# EAGLE design sensor (EAGLE 9.2.2)
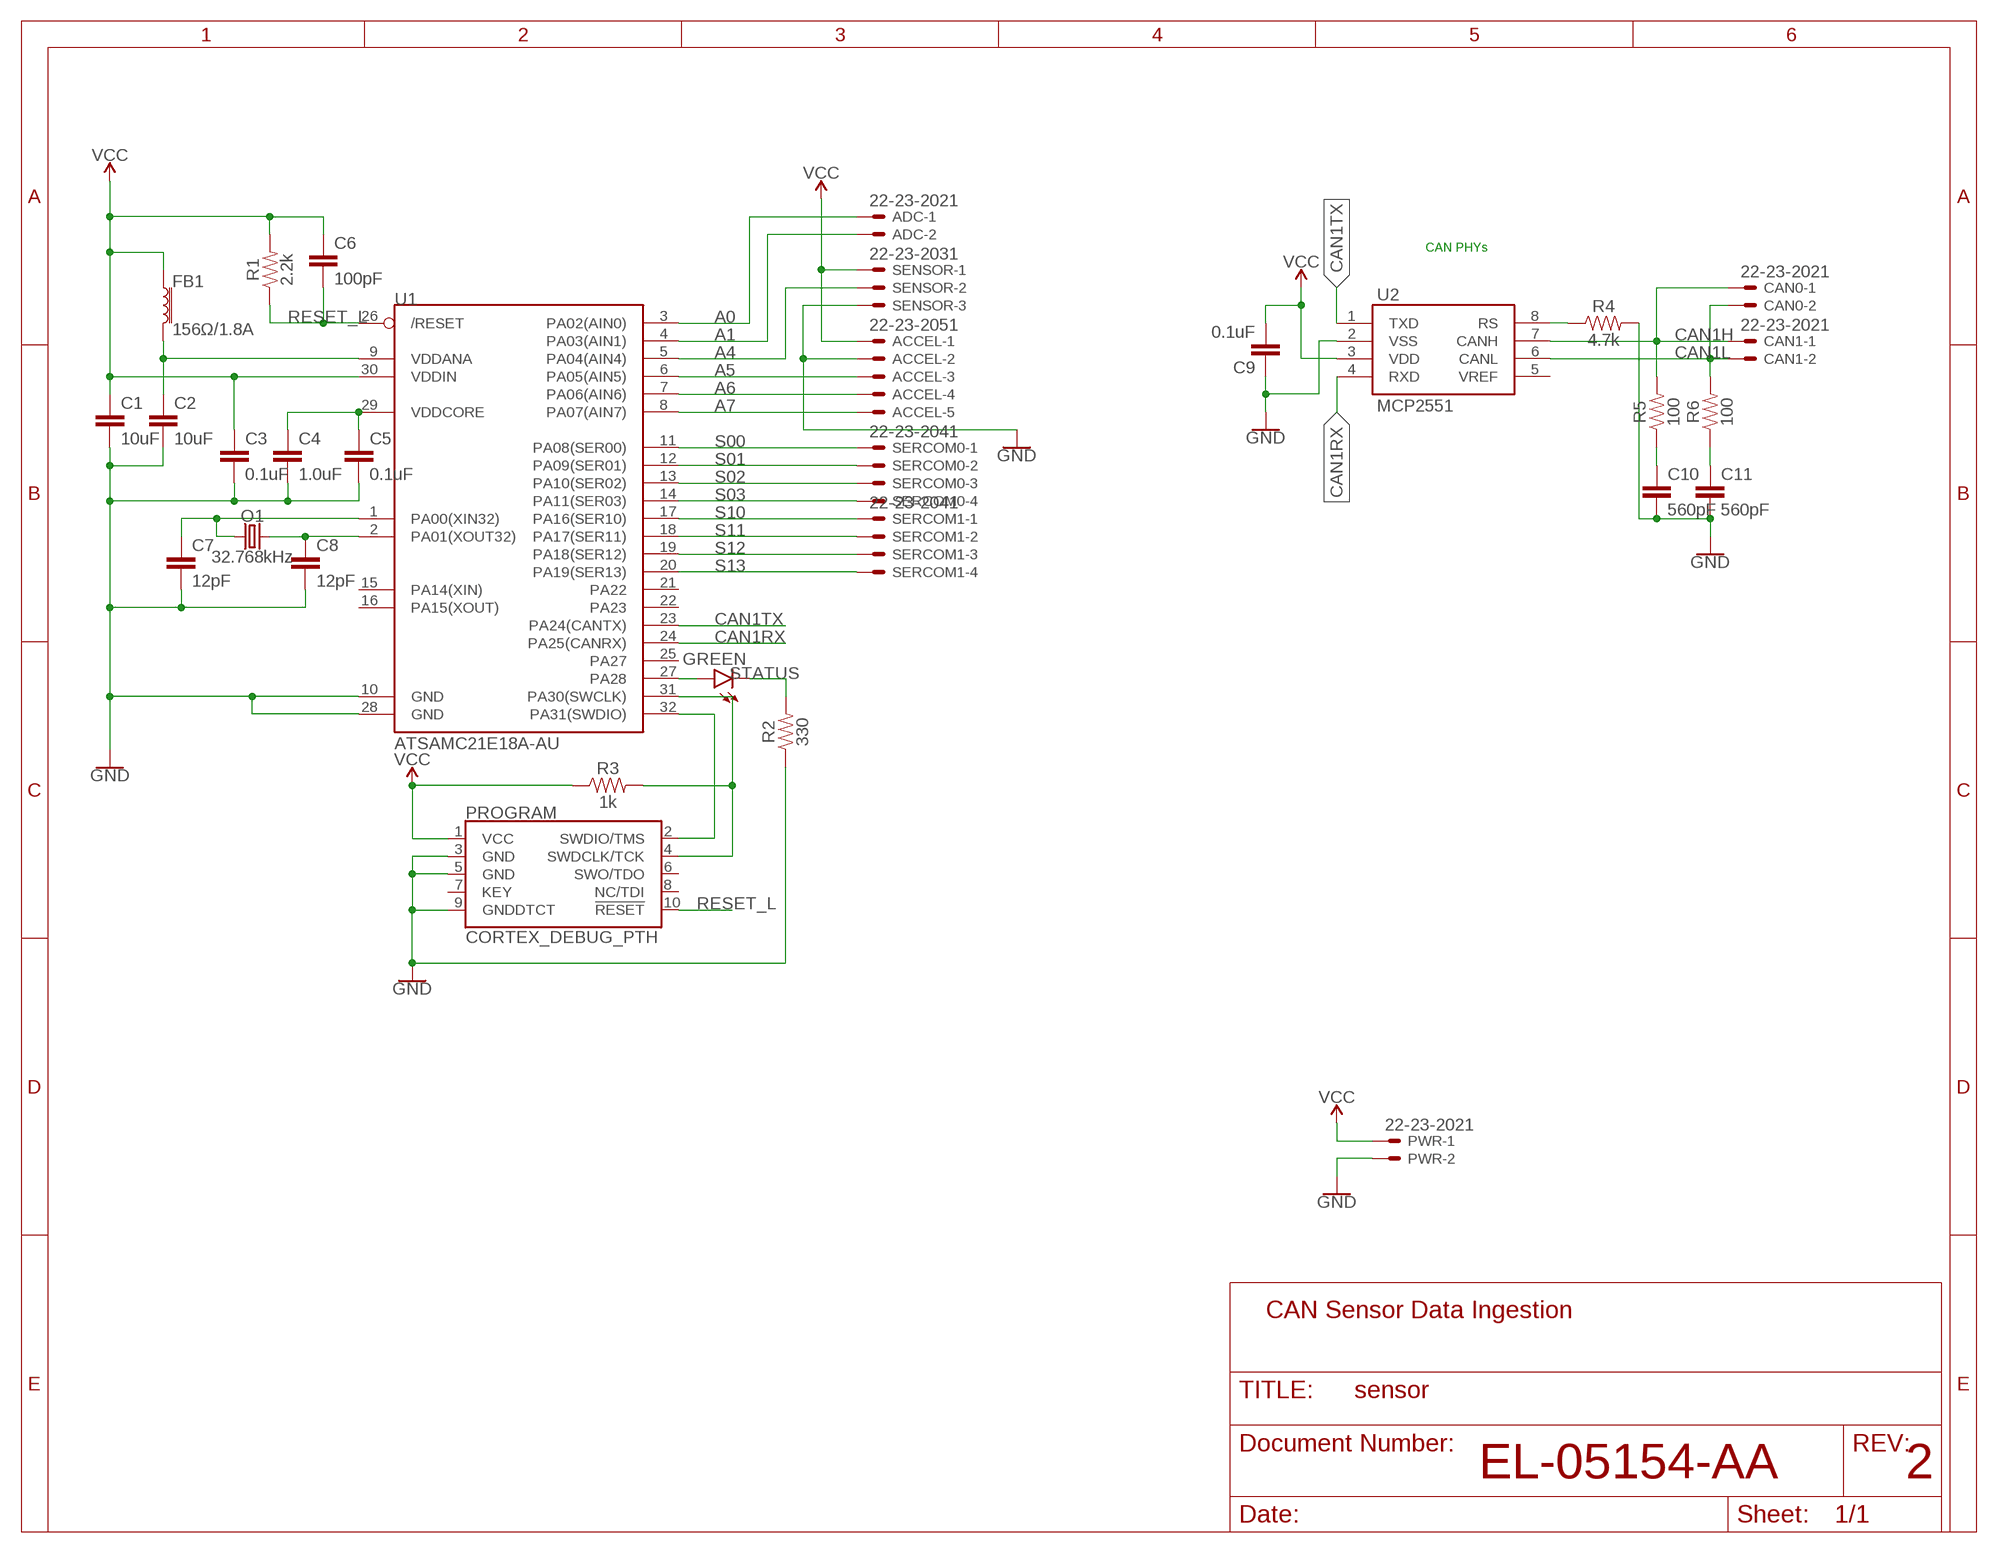
[diagram p0: schematic, sheet 1]

## Parts
ACCEL  22-23-2051  [22-23-2051]
ADC  22-23-2021  [22-23-2021]
C1  10uF  10UF-0603-6.3V-20%  [0603]
C2  10uF  10UF-0603-6.3V-20%  [0603]
C3  0.1uF  0.1UF-0603-25V-(+80/-20%)  [0603]
C4  1.0uF  1.0UF-0603-16V-10%  [0603]
C5  0.1uF  0.1UF-0603-25V-(+80/-20%)  [0603]
C6  100pF  100PF-0603-50V-5%  [0603]
C7  12pF  12PF-0603-50V-5%  [0603]
C8  12pF  12PF-0603-50V-5%  [0603]
C9  0.1uF  0.1UF-0603-25V-(+80/-20%)  [0603]
C10  560pF  560PF-0603-50V-5%  [0603]
C11  560pF  560PF-0603-50V-5%  [0603]
CAN0  22-23-2021  [22-23-2021]
CAN1  22-23-2021  [22-23-2021]
FB1  156Ω/1.8A  FERRITE_BEAD-0603  [0603]
O1  32.768kHz  CRYSTAL-32.768KHZPTH-2X6  [CRYSTAL-PTH-2X6-CYL]
PROGRAM  CORTEX_DEBUG_PTH  [2X5-PTH-1.27MM]
PWR  22-23-2021  [22-23-2021]
R1  2.2k  2.2KOHM-0603-1/10W-1%  [0603]
R2  330  330OHM-0603-1/10W-1%  [0603]
R3  1k  1KOHM-0603-1/10W-1%  [0603]
R4  4.7k  4.7KOHM-0603-1/10W-1%  [0603]
R5  100  100OHM-0603-1/4W-5%  [0603]
R6  100  100OHM-0603-1/4W-5%  [0603]
SENSOR  22-23-2031  [22-23-2031]
SERCOM0  22-23-2041  [22-23-2041]
SERCOM1  22-23-2041  [22-23-2041]
STATUS  GREEN  LED3MM  [LED_3MM]
U1  ATSAMC21E18A-AU  [TQFP32-08]
U2  MCP2551  [SO08]

## Nets
A0: ADC.1 U1.3(PA02(AIN0))
A1: ADC.2 U1.4(PA03(AIN1))
A4: SENSOR.2 U1.5(PA04(AIN4))
A5: ACCEL.3 U1.6(PA05(AIN5))
A6: ACCEL.4 U1.7(PA06(AIN6))
A7: ACCEL.5 U1.8(PA07(AIN7))
C1HRC: C10.1 R5.1
C1LRC: C11.1 R6.1
C1RS: R4.1 U2.8(RS)
CAN1H: CAN0.1 CAN1.1 R5.2 U2.7(CANH)
CAN1L: CAN0.2 CAN1.2 R6.2 U2.6(CANL)
CAN1RX: U1.24(PA25(CANRX)) U2.4(RXD)
CAN1TX: U1.23(PA24(CANTX)) U2.1(TXD)
GND [power]: ACCEL.2 C1.2 C2.2 C3.2 C4.2 C5.2 C7.2 C8.2 C9.1 C10.2 C11.2 PROGRAM.3(GND) PROGRAM.5(GND) PROGRAM.9(GNDDTCT) PWR.2 R2.1 R4.2 SENSOR.3 U1.10(GND) U1.28(GND) U2.2(VSS)
LEDA: STATUS.A U1.27(PA28)
LEDC: R2.2 STATUS.K(C)
RESET_L: C6.2 PROGRAM.10(!RESET) R1.1 U1.26(/RESET)
S00: SERCOM0.1 U1.11(PA08(SER00))
S01: SERCOM0.2 U1.12(PA09(SER01))
S02: SERCOM0.3 U1.13(PA10(SER02))
S03: SERCOM0.4 U1.14(PA11(SER03))
S10: SERCOM1.1 U1.17(PA16(SER10))
S11: SERCOM1.2 U1.18(PA17(SER11))
S12: SERCOM1.3 U1.19(PA18(SER12))
S13: SERCOM1.4 U1.20(PA19(SER13))
SWDCLK: PROGRAM.4(SWDCLK/TCK) R3.2 U1.31(PA30(SWCLK))
SWDIO: PROGRAM.2(SWDIO/TMS) U1.32(PA31(SWDIO))
VCC [power]: ACCEL.1 C1.1 C3.1 C6.1 C9.2 FB1.1 PROGRAM.1(VCC) PWR.1 R1.2 R3.1 SENSOR.1 U1.30(VDDIN) U2.3(VDD)
VDDANA: C2.1 FB1.2 U1.9(VDDANA)
VDDCORE: C4.1 C5.1 U1.29(VDDCORE)
XIN32: C7.1 O1.1 U1.1(PA00(XIN32))
XOUT32: C8.1 O1.2 U1.2(PA01(XOUT32))
Unconnected: PROGRAM.6(SWO/TDO) PROGRAM.7(KEY) PROGRAM.8(NC/TDI) U1.15(PA14(XIN)) U1.16(PA15(XOUT)) U1.21(PA22) U1.22(PA23) U1.25(PA27) U2.5(VREF)

## Notes on the sheet
- CAN PHYs
- CAN Sensor Data Ingestion
- EL-05154-AA | 2

## Library data of the parts
ACCEL = con-molex:22-23-2051: .100" (2.54mm) Center Header - 5 Pin; MF: MOLEX; MPN: 22-23-2051; OC_FARNELL: 1462952; OC_NEWARK: 38C9178
ADC CAN0 CAN1 PWR = con-molex:22-23-2021: .100" (2.54mm) Center Header - 2 Pin; MF: MOLEX; MPN: 22-23-2021; OC_FARNELL: 1462926; OC_NEWARK: 25C3832
C1 C2 = SparkFun-Capacitors:10UF: 10.0µF ceramic capacitors A capacitor is a passive two-terminal electrical component used to store electrical energy temporarily in an electric field.; PROD_ID: CAP-11015
C3 C5 C9 = SparkFun-Capacitors:0.1UF: 0.1µF ceramic capacitors A capacitor is a passive two-terminal electrical component used to store electrical energy temporarily in an electric field.; PROD_ID: CAP-00810
C4 = SparkFun-Capacitors:1.0UF: 1µF ceramic capacitors A capacitor is a passive two-terminal electrical component used to store electrical energy temporarily in an electric field.; PROD_ID: CAP-00868
C6 = SparkFun-Capacitors:100PF: 100pF/0.1nF ceramic capacitors A capacitor is a passive two-terminal electrical component used to store electrical energy temporarily in an electric field.; PROD_ID: CAP-07883
C7 C8 = SparkFun-Capacitors:12PF: 12pF ceramic capacitors A capacitor is a passive two-terminal electrical component used to store electrical energy temporarily in an electric field.; PROD_ID: CAP-09137
C10 C11 = SparkFun-Capacitors:560PF: 0.56nF/560pF ceramic capacitors A capacitor is a passive two-terminal electrical component used to store electrical energy temporarily in an electric field.; PROD_ID: CAP-08749
FB1 = SparkFun-Coils:FERRITE_BEAD: Ferrite Bead (blocks, cores, rings, chokes, etc.) Inductor with layers of ferrite used to suppress high frequencies. Often used to isolate high frequency noise. SparkFun Products: IOIO-OTG - V2.2 <https://www.sparkfun.com/products/13613> SparkFun SAMD21 Mini Breakout <https://www.sparkfun.com/products/13664> SparkFun 6 Degrees of Freedom Breakout - LSM6DS3 <https://www.sparkfun.com/products/13339> SparkFun SAMD21 Dev Breakout <https://www.sparkfun.com/products/13672>; PROD_ID: NDUC-07859; VALUE: 30Ω/1.8A
O1 = SparkFun-Clocks:CRYSTAL-32.768KHZ: 32.768kHz Crystal Frequency: 32.768kHz Frequency Stability: ±20ppm Load Capacitance: 12.5pF (PTH-2X6 & SMD-3.2X1.5), 6pF (SMD-2X6) SparkFun Products: SparkFun BigTime Watch Kit <https://www.sparkfun.com/products/11734> SparkFun nRF52832 Breakout <https://www.sparkfun.com/products/13990> SparkFun Real Time Clock Module <https://www.sparkfun.com/products/12708>; PROD_ID: XTAL-10112
PROGRAM = SparkFun-Connectors:CORTEX_DEBUG: Cortex Debug Connector - 10 pin Supports JTAG debug, Serial Wire debug, and Serial Wire Viewer. PTH and SMD connector options available. General Connector Information <http://infocenter.arm.com/help/topic/com.arm.doc.faqs/attached/13634/cortex_debug_connectors.pdf> Products: PTH Connector <http://www.digikey.com/product-detail/en/cnc-tech/3220-10-0100-00/1175-1627-ND/3883661> -via Digi-Key SparkFun PSoc <https://www.sparkfun.com/products/13229> SparkFun T <https://www.sparkfun.com/products/13810>
R1 = SparkFun-Resistors:2.2KOHM: 2.2kΩ resistor A resistor is a passive two-terminal electrical component that implements electrical resistance as a circuit element. Resistors act to reduce current flow, and, at the same time, act to lower voltage levels within circuits. - Wikipedia; PROD_ID: RES-08272
R2 = SparkFun-Resistors:330OHM: 330Ω resistor A resistor is a passive two-terminal electrical component that implements electrical resistance as a circuit element. Resistors act to reduce current flow, and, at the same time, act to lower voltage levels within circuits. - Wikipedia; PROD_ID: RES-00818
R3 = SparkFun-Resistors:1KOHM: 1kΩ resistor A resistor is a passive two-terminal electrical component that implements electrical resistance as a circuit element. Resistors act to reduce current flow, and, at the same time, act to lower voltage levels within circuits. - Wikipedia; PROD_ID: RES-07856
R4 = SparkFun-Resistors:4.7KOHM: 4.7kΩ resistor A resistor is a passive two-terminal electrical component that implements electrical resistance as a circuit element. Resistors act to reduce current flow, and, at the same time, act to lower voltage levels within circuits. - Wikipedia; PROD_ID: RES-07857
R5 R6 = SparkFun-Resistors:100OHM: 100Ω resistor A resistor is a passive two-terminal electrical component that implements electrical resistance as a circuit element. Resistors act to reduce current flow, and, at the same time, act to lower voltage levels within circuits. - Wikipedia; PROD_ID: RES-12438
SENSOR = con-molex:22-23-2031: .100" (2.54mm) Center Header - 3 Pin; MF: MOLEX; MPN: 22-23-2031; OC_FARNELL: 1462950; OC_NEWARK: 30C0862
SERCOM0 SERCOM1 = con-molex:22-23-2041: .100" (2.54mm) Center Header - 4 Pin; MF: MOLEX; MPN: 22-23-2041; OC_FARNELL: 1462920; OC_NEWARK: 38C0355
STATUS = SparkFun-LED:LED: LED (Generic) Standard schematic elements and footprints for 5mm, 3mm, 1206, and 0603 sized LEDs. Generic LEDs with no color specified.; PROD_ID: DIO-08794
U1 = washuracing:ATSAMC21E18A-AU: 5-Volt 32-Bit ARM Cortex M0+ MCU with CAN-FD
U2 = SparkFun-IC-Comms:MCP2551: MCP2551 High Speed CAN Transceiver High speed CAN transceiver Datasheet <http://www.sparkfun.com/datasheets/DevTools/Arduino/MCP2551.pdf> SparkFun Products CAN-BUS Shield <https://www.sparkfun.com/products/13262> (DEV-13262) SparkFun OBD-II UART <https://www.sparkfun.com/products/9555> (WIG-09555); PROD_ID: IC-09907

## Net classes
0 default: width 0.203 mm
1 power: width 0.406 mm

## Board
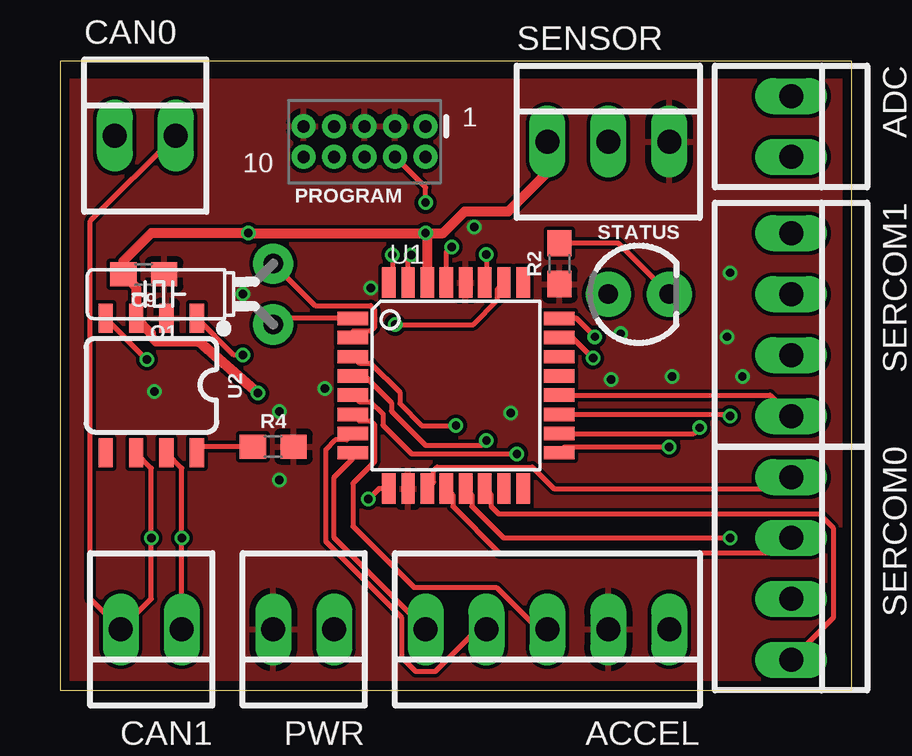
[diagram p1: board, top side]
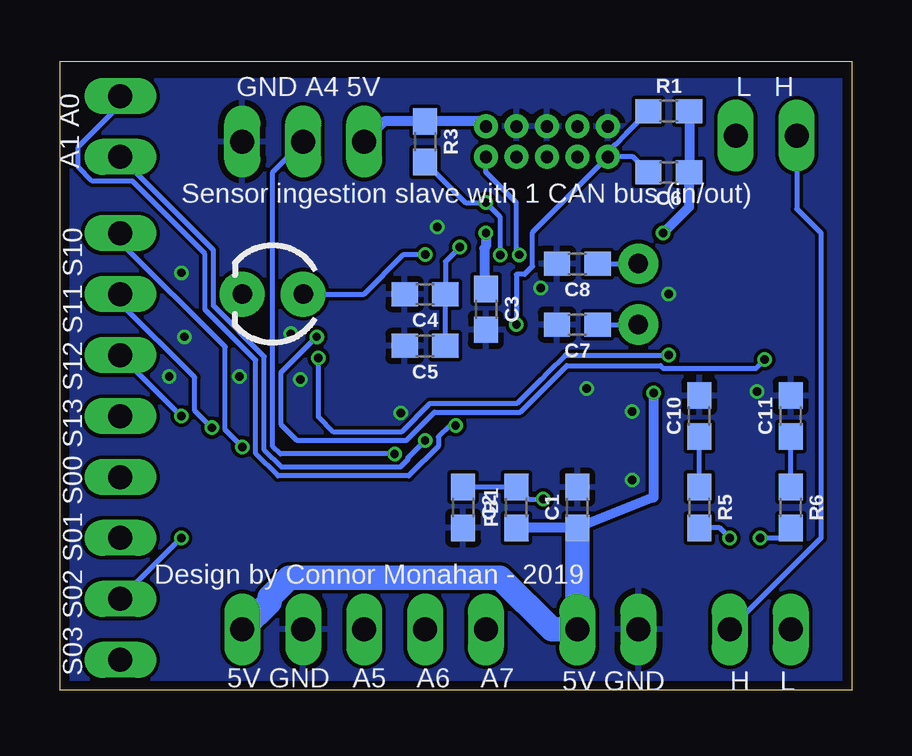
[diagram p2: board, bottom side, seen from below]

Size 33 x 26.21 mm. Coordinates in mm from the lower left corner, seen from the top.
Outline: 0,0 33,0 33,26.21 0,26.21 0,0
Copper layers (1*16): Top 0.035559375mm / dielectric 1.6mm / Bottom 0.035559375mm
Design rules "oshpark-2layer *": minimum track width 6mil, minimum drill 10mil, track to track 6mil, track to pad 6mil, pad to pad 6mil, via to via 6mil, smd to smd 6mil, copper to edge 15mil, drill to drill 6mil, minimum pad ring 5mil, minimum via ring 5mil, stop-mask expansion 2.5mil, vias tented up to drill 20mil, thermal gap 10mil

### Footprints (pad centres in the part's own frame; a part is rotated, then mirrored left to right if it is on the bottom)
22-23-2051 = drill 1 long: 1 -5.08,0; 2 -2.54,0; 3 0,0; 4 2.54,0; 5 5.08,0
22-23-2021 = drill 1 long: 1 -1.27,0; 2 1.27,0
0603 = smd 1.1 x 1: 1 -0.85,0; 2 0.85,0
CRYSTAL-PTH-2X6-CYL = drill 0.813 pad 1.676: 1 -1.27,0; 2 1.27,0
2X5-PTH-1.27MM = drill 0.508 pad 1: 1 -2.54,-0.635; 2 -2.54,0.635; 3 -1.27,-0.635; 4 -1.27,0.635; 5 0,-0.635; 6 0,0.635; 7 1.27,-0.635; 8 1.27,0.635; 9 2.54,-0.635; 10 2.54,0.635
22-23-2031 = drill 1 long: 1 -2.54,0; 2 0,0; 3 2.54,0
22-23-2041 = drill 1 long: 1 -3.81,0; 2 -1.27,0; 3 1.27,0; 4 3.81,0
LED_3MM = drill 0.813 pad 1.88: A -1.27,0; K 1.27,0
TQFP32-08 = smd 1.27 x 0.559: 1 -4.293,2.8; 2 -4.293,2; 3 -4.293,1.2; 4 -4.293,0.4; 5 -4.293,-0.4; 6 -4.293,-1.2; 7 -4.293,-2; 8 -4.293,-2.8; 17 4.293,-2.8; 18 4.293,-2; 19 4.293,-1.2; 20 4.293,-0.4; 21 4.293,0.4; 22 4.293,1.2; 23 4.293,2; 24 4.293,2.8 | smd 0.559 x 1.27: 9 -2.8,-4.293; 10 -2,-4.293; 11 -1.2,-4.293; 12 -0.4,-4.293; 13 0.4,-4.293; 14 1.2,-4.293; 15 2,-4.293; 16 2.8,-4.293; 25 2.8,4.293; 26 2,4.293; 27 1.2,4.293; 28 0.4,4.293; 29 -0.4,4.293; 30 -1.2,4.293; 31 -2,4.293; 32 -2.8,4.293
SO08 = smd 0.6 x 1.2: 1 -1.905,-2.8; 2 -0.635,-2.8; 3 0.635,-2.8; 4 1.905,-2.8; 5 1.905,2.8; 6 0.635,2.8; 7 -0.635,2.8; 8 -1.905,2.8

### Placement (x,y rotation side)
ACCEL  20.32,2.54 180 top
ADC  30.48,23.5 270 top
C1  11.43,7.62 90 bottom
C2  16.19,7.62 270 bottom
C3  15.24,15.88 270 bottom
C4  17.78,16.51 180 bottom
C5  17.78,14.35 180 bottom
C6  7.62,21.59 180 bottom
C7  11.43,15.24 180 bottom
C8  11.43,17.78 180 bottom
C9  3.49,17.34 180 top
C10  6.35,11.43 90 bottom
C11  2.54,11.43 90 bottom
CAN0  3.56,23.11 0 top
CAN1  3.81,2.54 180 top
FB1  13.97,7.62 90 bottom
O1  8.89,16.51 90 top
PROGRAM  12.7,22.86 180 top
PWR  10.16,2.54 180 top
R1  7.62,24.13 0 bottom
R2  20.83,17.78 90 top
R3  17.78,22.86 270 bottom
R4  8.89,10.16 0 top
R5  6.35,7.62 270 bottom
R6  2.54,7.62 270 bottom
SENSOR  22.86,22.86 0 top
SERCOM0  30.48,5.08 270 top
SERCOM1  30.48,15.24 270 top
STATUS  24.13,16.51 0 top
U1  16.51,12.7 0 top
U2  3.81,12.7 180 top

### Tracks (layer width: path | path; a pad name or v marks a point on that pad's centre or on a via)
A0  (via drill 0.35)
  Top 0.203: v16.51,11.03 15.08,11.03 14.17,11.94 14.17,12.42 12.96,13.63 12.48,13.63 U1.3
  Bottom 0.203: v16.51,11.03 16.75,11.03 17.22,10.56 17.22,10.18 18.46,8.94 23.92,8.94 24.84,9.87 24.84,13.76 26.95,15.87 26.95,18.19 29.98,21.22 31.65,21.22 32.23,21.81 32.23,22.64 30.48,24.39 ADC.1
A1  (via drill 0.35)
  Top 0.203: U1.4 12.69,13.1 13.82,11.97 13.82,11.63 15.24,10.21 17.58,10.21 v17.78,10.41
  Bottom 0.203: ADC.2 26.59,18.34 26.59,16.02 24.49,13.91 24.49,10.01 23.77,9.3 18.82,9.3 18.49,9.62 18.49,9.69 v17.78,10.41
A4  (via drill 0.35)
  Top 0.203: v19.05,9.85 14.66,9.85 13.46,11.05 13.46,11.53 12.96,12.03 12.48,12.03 U1.5
  Bottom 0.203: v19.05,9.85 23.82,9.85 24.13,10.16 24.13,21.59 SENSOR.2
A5
  Top 0.203: U1.6 12.48,11.23 12.96,11.23 13.11,11.09 13.11,9.52 12.22,8.63 12.22,6.83 14.76,4.29 18.2,4.29 19.95,2.54 ACCEL.3
A6
  Top 0.203: U1.7 11.95,10.43 11.48,10.43 11.07,10.03 11.07,6.2 14.24,3.04 14.24,1.37 14.82,0.79 15.66,0.79 17.41,2.54 ACCEL.4
A7
  Top 0.203: U1.8 12.22,9.68 11.43,8.89 11.43,6.35 ACCEL.5
C1HRC
  Bottom 0.203: R5.1 C10.1
C1LRC
  Bottom 0.203: R6.1 C11.1
C1RS
  Top 0.203: R4.1 5.97,10.16 U2.8
CAN1H  (via drill 0.35)
  Top 0.203: CAN1.1 v5.08,6.35 5.08,9.27 U2.7
  Bottom 0.203: CAN1.1 1.27,6.35 1.27,19.05 2.29,20.07 CAN0.1 | v5.08,6.35 5.5,6.77 R5.2
CAN1L  (via drill 0.35)
  Top 0.203: CAN0.2 1.27,19.56 1.27,3.81 CAN1.2 3.81,3.81 v3.81,6.35 3.81,9.27 U2.6
  Bottom 0.203: v3.81,6.35 2.96,6.35 R6.2
CAN1RX  (via drill 0.35)
  Top 0.203: U2.4 v3.62,13.78 | v22.3,14.73 21.53,15.5 U1.24
  Bottom 0.203: v22.3,14.73 23.77,13.26 23.77,11.07 23.11,10.41 18.57,10.41 17.38,11.59 13.81,11.59 11.87,13.53 7.96,13.53 7.85,13.41 3.99,13.41 v3.62,13.78
CAN1TX  (via drill 0.35)
  Top 0.203: v22.23,13.84 21.37,14.7 U1.23 | v7.62,13.97 7.25,13.97 U2.1
  Bottom 0.203: v22.23,13.84 22.23,11.4 21.59,10.76 18.77,10.76 17.59,11.95 13.96,11.95 12.95,12.95 12.65,13.26 11.93,13.97 v7.62,13.97
GND  (via drill 0.35)
  other vias: 17.27,19.3 18.8,11.56 23.37,14.86 3.94,12.45 7.62,16.51 12.95,16.76 11.05,12.57 22.99,12.95 25.53,13.08 27.81,14.73 28.45,13.08 27.94,17.4 9.14,11.62 9.14,8.76
  pour Top: 0,0 0,25.4 33.02,25.4 33.02,0
  pour Bottom: 0,0 0,25.4 33.02,25.4 33.02,0
LEDA  (via drill 0.35)
  Top 0.203: v17.78,18.16 17.78,17.06 U1.27
  Bottom 0.203: STATUS.A 20.32,16.51 18.67,18.16 v17.78,18.16
LEDC
  Top 0.203: R2.2 23.28,18.63 STATUS.K
RESET_L  (via drill 0.35)
  Top 0.203: U1.26 18.24,16.73 18.24,16.25 17.23,15.24 v13.97,15.24
  Bottom 0.203: PROGRAM.10 13.3,19.09 13.3,17.66 13.63,17.34 13.97,17.34 v13.97,15.24 | PROGRAM.10 10.16,22.44 9.86,22.74 9.85,22.74 9.41,23.18 9.41,23.19 R1.1 | C6.2 9.11,22.23 PROGRAM.10
S00
  Top 0.203: SERCOM0.1 30,8.41 20.58,8.41 19.7,9.3 15.72,9.3 15.58,9.15 15.58,8.67 U1.11
S01
  Top 0.203: U1.12 16.38,8.14 16.38,7.67 18.33,5.71 29.84,5.71 SERCOM0.2
S02  (via drill 0.35)
  Top 0.203: U1.13 17.18,8.14 17.18,7.67 18.49,6.35 v27.94,6.35
  Bottom 0.203: v27.94,6.35 SERCOM0.3
S03
  Top 0.203: U1.14 17.98,8.14 17.98,7.67 18.29,7.35 31.65,7.35 32.23,6.77 32.23,3.02 SERCOM0.4
S10  (via drill 0.35)
  Top 0.203: U1.17 21.05,10.14 v25.4,10.14
  Bottom 0.203: v25.4,10.14 26.11,10.86 26.11,14.31 30.48,18.68 SERCOM1.1
S11  (via drill 0.35)
  Top 0.203: U1.18 26.43,10.7 v26.67,10.94
  Bottom 0.203: v26.67,10.94 27.38,11.66 27.38,13.04 30.48,16.14 SERCOM1.2
S12  (via drill 0.35)
  Top 0.203: U1.19 27.87,11.5 v27.94,11.43
  Bottom 0.203: v27.94,11.43 SERCOM1.3
S13
  Top 0.203: U1.20 29.61,12.3 SERCOM1.4
SWDCLK  (via drill 0.35)
  Top 0.203: U1.31 14.51,18 v14.65,18.15 | v15.24,20.32 15.24,20.95 PROGRAM.4
  Bottom 0.203: v14.65,18.15 14.65,19.73 v15.24,20.32 16.09,20.32 R3.2
SWDIO  (via drill 0.35)
  Top 0.203: U1.32 13.86,17.14 v13.86,18.15
  Bottom 0.203: v13.86,18.15 13.97,18.26 13.97,20.32 15.24,21.59 PROGRAM.2
VCC  (via drill 0.35)
  Top 0.406: v15.24,19.05 15.31,18.98 U1.30 | v15.24,19.05 v7.86,19.05 3.81,19.05 2.64,17.88 C9.2 3.17,16.8 U2.3 3.79,14.89 3.79,14.75 4,14.54 5.78,14.54 v8.26,12.38 | v15.24,19.05 15.97,19.05 16.88,19.96 18.69,19.96 20.32,21.59 SENSOR.1
  Bottom 0.406: FB1.1 C1.1 8.26,8.04 v8.26,12.38 | v15.24,19.05 15.24,18.49 15.31,18.42 15.31,16.8 C3.1 | R1.2 C6.1 6.77,20.14 v7.86,19.05 | PROGRAM.1 15.46,23.71 R3.1 19.47,23.71 SENSOR.1
  Bottom 1.016: ACCEL.1 24.27,3.67 24.27,3.87 23.44,4.7 14.66,4.7 12.49,2.54 PWR.1 C1.1
VDDANA  (via drill 0.35)
  Top 0.203: U1.9 13.29,8.41 v12.86,7.97
  Bottom 0.203: C2.1 FB1.2 13.47,7.97 v12.86,7.97
VDDCORE  (via drill 0.35)
  Top 0.203: U1.29 16.11,18.26 v16.32,18.47
  Bottom 0.203: C5.1 C4.1 16.93,17.87 v16.32,18.47
XIN32
  Top 0.203: U1.1 9.15,15.5 O1.1
  Bottom 0.203: C7.1 O1.1
XOUT32
  Top 0.203: U1.2 11.97,14.7 12.24,14.97 12.96,14.97 13.11,15.12 13.11,15.88 12.96,16.03 10.64,16.03 O1.2
  Bottom 0.203: C8.1 O1.2

### Text on the board
tPlace: 1 | 10
bPlace: L H | GND A4 5V | A1 A0 | Sensor ingestion slave with 1 CAN bus (in/out) | S03 S02 S01 S00 S13 S12 S11 S10 | Design by Connor Monahan - 2019 | H L | 5V GND | 5V GND A5 A6 A7